# Altium schematic sheet Sheet_1_2022-09-27.schdoc
size 289 x 156 mm
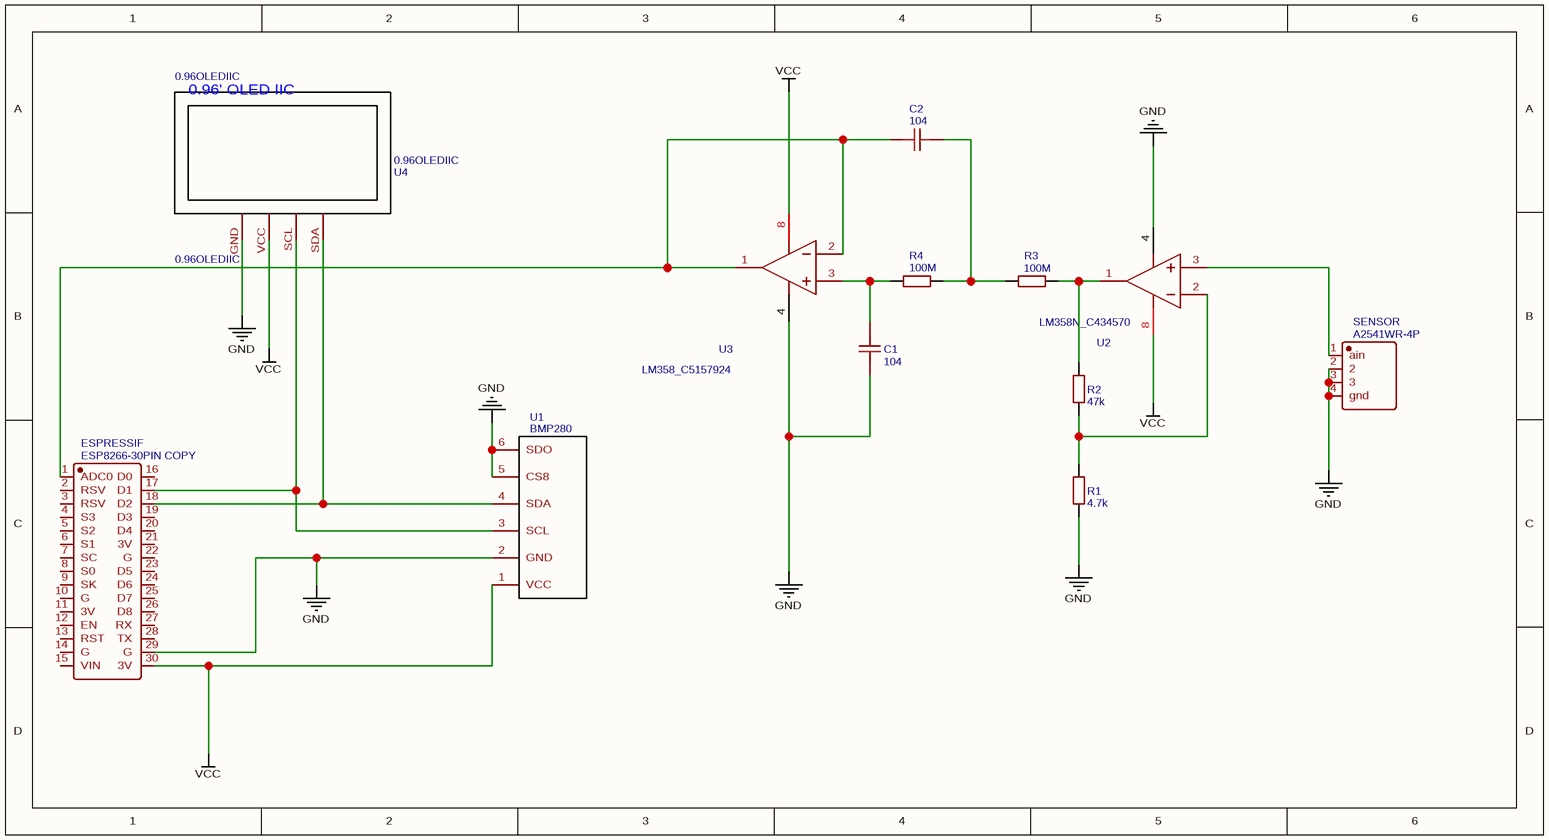
[diagram p0: Sheet_1_2022-09-27.schdoc]

## Parts
C1  104  [CAP-TH_L5.5-W3.2-P2.50-D0.5]
C2  104  [CAP-TH_L5.5-W3.2-P2.50-D0.5]
ESPRESSIF  ESP8266-30PIN COPY  [ESP8266NODEMCU]
R1  4.7k  [RES-TH_BD5.5-L15.0-P19.00-D0.8]
R2  47k  [RES-TH_BD5.5-L15.0-P19.00-D0.8]
R3  100M  [RES-TH_BD5.5-L15.0-P19.00-D0.8]
R4  100M  [RES-TH_BD5.5-L15.0-P19.00-D0.8]
SENSOR  A2541WR-4P  [HDR-TH_4P-P2.54-H-M-W10.3]
U1  BMP280  [BMP280]
U2  LM358N_C434570  [DIP-8_L9.2-W6.3-P2.54-LS7.62-BL]
U3  LM358_C5157924  [PDIP-8_L9.3-W6.4-P2.54-LS7.6-BL]
U4  0.96OLEDIIC  [0.96OLEDIIC]

## Nets
GND: C1.1 ESPRESSIF.29(G) R1.1 SENSOR.2 SENSOR.3 SENSOR.4(gnd) U1.2(GND) U1.5(CS8) U1.6(SDO) U2.4(GND) U3.4(GND) U4.GND
VCC: ESPRESSIF.30(3V) U1.1(VCC) U2.8(VCC) U3.8(VCC) U4.VCC
NetC1_2: C1.2 R4.1 U3.3(IN1+)
NetC2_1: C2.1 ESPRESSIF.1(ADC0) U3.1(OUT1) U3.2(IN1-)
NetC2_2: C2.2 R3.1 R4.2
NetESPRESSIF_17: ESPRESSIF.17(D1) U1.3(SCL) U4.SCL
NetESPRESSIF_18: ESPRESSIF.18(D2) U1.4(SDA) U4.SDA
NetR1_2: R1.2 R2.1 U2.2(IN1-)
NetR2_2: R2.2 R3.2 U2.1(OUT1)
NetSENSOR_1: SENSOR.1(ain) U2.3(IN1+)

Not connected (* = marked no-connect by the designer): ESPRESSIF 2(RSV) 3(RSV) 4(S3) 5(S2) 6(S1) 7(SC) 8(S0) 9(SK) 10(G) 11(3V) 12(EN) 13(RST) 14(G) 15(VIN) 16(D0) 19(D3) 20(D4) 21(3V) 22(G) 23(D5) 24(D6) 25(D7) 26(D8) 27(RX) 28(TX)

## Notes on the sheet
- (in symbol 0.96OLEDIIC) 0.96' OLED IIC

## Library data of the parts
C1 C2 = 104: BOM_Manufacturer: muRata(村田); BOM_Manufacturer Part: RCER71E475K2DBH03A; nameAlias: Capacitance; Contributor: LCSC; BOM_Supplier: LCSC; BOM_Supplier Part: C1622251; BOM_JLCPCB Part Class: Extended Part; spicePre: C; spiceSymbolName: RCER71E475K2DBH03A
ESPRESSIF = ESP8266-30PIN COPY: Contributor: 123r3; spicePre: E; spiceSymbolName: ESP8266-30PIN COPY
R1 = 4.7k: BOM_Manufacturer: UniOhm; BOM_Manufacturer Part: MGR02SJ0302AA0; nameAlias: Resistance (Ohms); Resistance: 3kΩ; BOM_Supplier: LCSC; BOM_Supplier Part: C74658; BOM_JLCPCB Part Class: Extended Part; spicePre: R; spiceSymbolName: MGR02SJ0302AA0
R2 = 47k: BOM_Manufacturer: UniOhm; BOM_Manufacturer Part: MGR02SJ0302AA0; nameAlias: Resistance (Ohms); Resistance: 3kΩ; BOM_Supplier: LCSC; BOM_Supplier Part: C74658; BOM_JLCPCB Part Class: Extended Part; spicePre: R; spiceSymbolName: MGR02SJ0302AA0
R3 R4 = 100M: BOM_Manufacturer: UniOhm; BOM_Manufacturer Part: MGR02SJ0302AA0; nameAlias: Resistance (Ohms); Resistance: 3kΩ; BOM_Supplier: LCSC; BOM_Supplier Part: C74658; BOM_JLCPCB Part Class: Extended Part; spicePre: R; spiceSymbolName: MGR02SJ0302AA0
SENSOR = A2541WR-4P: BOM_Manufacturer: Changjiang Connectors; Contributor: LCSC; BOM_Supplier: LCSC; BOM_Supplier Part: C225490; BOM_Manufacturer Part: A2541WR-4P; BOM_JLCPCB Part Class: Extended Part; spicePre: H; spiceSymbolName: A2541WR-4P
U1 = BMP280: Contributor: eggfly; BOM_Manufacturer Part: BMP280; link: http://www.ebay.com/itm/5Pcs-BMP280-3-3V-Pressure-Sensor-Module-High-Precision-Atmospheric-Arduino-US-/142267570254?hash=item211fced84e:g:K50AAOSwImRYlXAm; spicePre: U; spiceSymbolName: BMP280
U2 = LM358N_C434570: BOM_Manufacturer: HGSEMI; BOM_Manufacturer Part: LM358N; subpart_no: 1; Contributor: LCSC; BOM_Supplier: LCSC; BOM_Supplier Part: C434570; BOM_JLCPCB Part Class: Extended Part; spicePre: U; spiceSymbolName: LM358N_C434570
U3 = LM358_C5157924: BOM_Manufacturer: Gcore(扬州国芯); BOM_Manufacturer Part: LM358; subpart_no: 1; Contributor: lcsc; BOM_Supplier: LCSC; BOM_Supplier Part: C5157924; link: https://atta.szlcsc.com/upload/public/pdf/source/20220906/3ACE6D6B047AB904F15AF865A5390D58.pdf; spicePre: U; spiceSymbolName: LM358_C5157924
U4 = 0.96OLEDIIC: Contributor: fyf132465798; Package Display: Yes; link: https://item.taobao.com/item.htm?spm=a1z09.2.0.0.5ea22e8doSvR53&id=562145367495&_u=r1ggn9c0621f; spicePre: U; spiceSymbolName: 0.96OLEDIIC